# Altium schematic sheet Current_Measure.SchDoc: Current_Measure
size A; DrawnBy: Tyler White; Engineer: Tyler White; SheetNumber: 10; SheetTotal: 16; SPICEModelCacheSKHIQDSK: <root> / <DocumentId>SKHIQDSK</DocumentId> / </root>
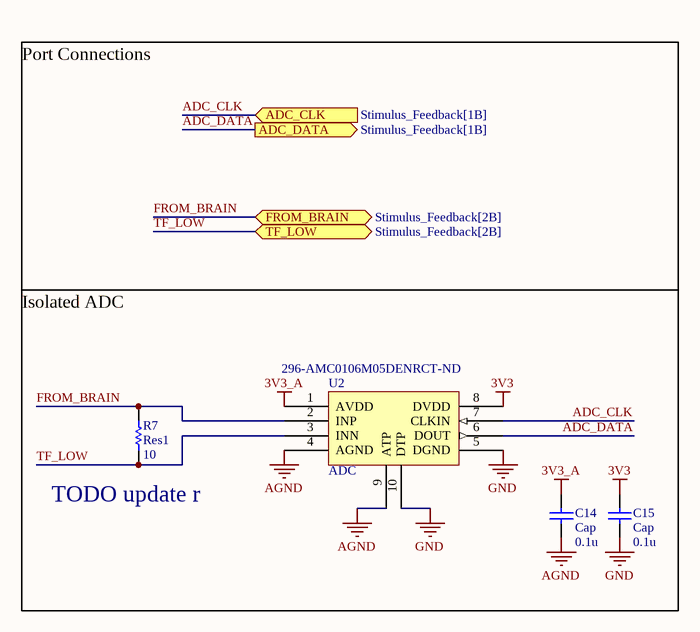
[diagram p0: Current_Measure.SchDoc]

## Parts
C14  Cap  value 0.1u  [CAPC1608X05N]
C15  Cap  value 0.1u  [CAPC1608X05N]
R7  Res1  value 10  [0402_Res]
U2  ADC  Supplier Part Number 1: 296-AMC0106M05DENRCT-ND  [SON65P350X100_HS-9N]

## Ports
ADC_CLK (in, see Stimulus_Feedback[1B]), ADC_DATA (out, see Stimulus_Feedback[1B]), FROM_BRAIN (bidir, see Stimulus_Feedback[2B]), TF_LOW (bidir, see Stimulus_Feedback[2B])

## Nets
3V3: C15.2 U2.8(DVDD)
3V3_A: C14.2 U2.1(AVDD)
AGND: C14.1 U2.4(AGND) U2.9(ATP)
GND: C15.1 U2.5(DGND) U2.10(DTP)
ADC_CLK: U2.7(CLKIN) ; port ADC_CLK
ADC_DATA: U2.6(DOUT) ; port ADC_DATA
FROM_BRAIN: R7.1 U2.2(INP) ; port FROM_BRAIN
TF_LOW: R7.2 U2.3(INN) ; port TF_LOW

## Notes on the sheet
- Port Connections
- Isolated ADC
- (near R7) TODO update r

## Library data of the parts
C14 C15 = Cap: Capacitor; Published: 8-Jun-2000; LatestRevisionDate: 17-Jul-2002; LatestRevisionNote: Re-released for DXP Platform.; PackageReference: RAD-0.3; Publisher: Altium Limited; PackageDescription: Radial Cap, Thru-Hole; 2 Leads; 0.3 in Pin Spacing
R7 = Res1: Resistor; Published: 8-Jun-2000; LatestRevisionDate: 17-Jul-2002; LatestRevisionNote: Re-released for DXP Platform.; PackageReference: AXIAL-0.3; Publisher: Altium Limited; PackageDescription: Axial Device, Thru-Hole; 2 Leads; 0.3 in Pin Spacing
U2 = ADC: Supplier 1: DigiKey